# EAGLE design P3DA (EAGLE 7.7.0)
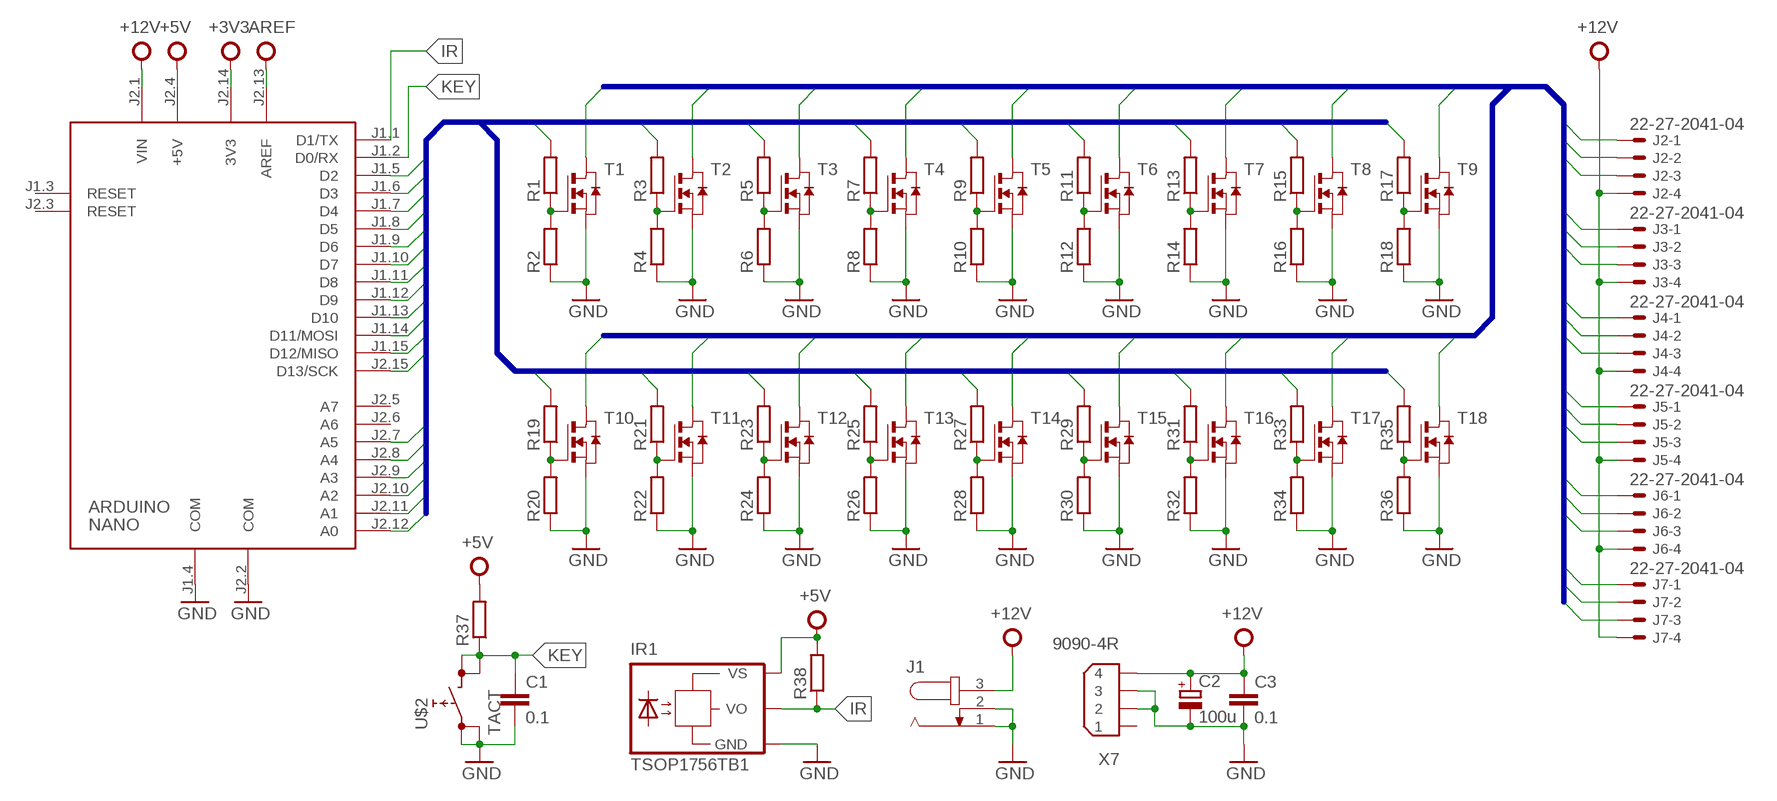
[diagram p0: schematic, sheet 1]

## Parts
ARDUINO  NANO  ARDUINO_NANO2  [ARDUINO_NANO2]
C1  0.1  C-EUC0805  [C0805]
C2  100u  CPOL-EUE5-13  [E5-13]
C3  0.1  C-EUC1206  [C1206]
IR1  TSOP1756TB1  [TSOP17_TB1]
J1  JACK-PLUG1  [SPC4078]
J2  22-27-2041-04  [6410-04]
J3  22-27-2041-04  [6410-04]
J4  22-27-2041-04  [6410-04]
J5  22-27-2041-04  [6410-04]
J6  22-27-2041-04  [6410-04]
J7  22-27-2041-04  [6410-04]
R1  R-EU_R0805  [R0805]
R2  R-EU_R0805  [R0805]
R3  R-EU_R0805  [R0805]
R4  R-EU_R0805  [R0805]
R5  R-EU_R0805  [R0805]
R6  R-EU_R0805  [R0805]
R7  R-EU_R0805  [R0805]
R8  R-EU_R0805  [R0805]
R9  R-EU_R0805  [R0805]
R10  R-EU_R0805  [R0805]
R11  R-EU_R0805  [R0805]
R12  R-EU_R0805  [R0805]
R13  R-EU_R0805  [R0805]
R14  R-EU_R0805  [R0805]
R15  R-EU_R0805  [R0805]
R16  R-EU_R0805  [R0805]
R17  R-EU_R0805  [R0805]
R18  R-EU_R0805  [R0805]
R19  R-EU_R0805  [R0805]
R20  R-EU_R0805  [R0805]
R21  R-EU_R0805  [R0805]
R22  R-EU_R0805  [R0805]
R23  R-EU_R0805  [R0805]
R24  R-EU_R0805  [R0805]
R25  R-EU_R0805  [R0805]
R26  R-EU_R0805  [R0805]
R27  R-EU_R0805  [R0805]
R28  R-EU_R0805  [R0805]
R29  R-EU_R0805  [R0805]
R30  R-EU_R0805  [R0805]
R31  R-EU_R0805  [R0805]
R32  R-EU_R0805  [R0805]
R33  R-EU_R0805  [R0805]
R34  R-EU_R0805  [R0805]
R35  R-EU_R0805  [R0805]
R36  R-EU_R0805  [R0805]
R37  R-EU_R0805  [R0805]
R38  R-EU_R0805  [R0805]
T1  NMOSSOT23  [SOT-23]
T2  NMOSSOT23  [SOT-23]
T3  NMOSSOT23  [SOT-23]
T4  NMOSSOT23  [SOT-23]
T5  NMOSSOT23  [SOT-23]
T6  NMOSSOT23  [SOT-23]
T7  NMOSSOT23  [SOT-23]
T8  NMOSSOT23  [SOT-23]
T9  NMOSSOT23  [SOT-23]
T10  NMOSSOT23  [SOT-23]
T11  NMOSSOT23  [SOT-23]
T12  NMOSSOT23  [SOT-23]
T13  NMOSSOT23  [SOT-23]
T14  NMOSSOT23  [SOT-23]
T15  NMOSSOT23  [SOT-23]
T16  NMOSSOT23  [SOT-23]
T17  NMOSSOT23  [SOT-23]
T18  NMOSSOT23  [SOT-23]
U$2  TACT  [TL1105]
X7  9090-4R  [9090-4R]

## Nets
+3V3: ARDUINO.J2.14(3V3)
+5V: ARDUINO.J2.4(+5V) IR1.VS R37.2 R38.2
+12V: ARDUINO.J2.1(VIN) C2.+ C3.1 J1.3 J2.4 J3.4 J4.4 J5.4 J6.4 J7.4 X7.4
AREF: ARDUINO.J2.13(AREF)
B1: J2.1 T3.1(D)
B2: J3.1 T6.1(D)
B3: J4.1 T9.1(D)
B4: J5.1 T12.1(D)
B5: J6.1 T15.1(D)
B6: J7.1 T18.1(D)
B_IN1: ARDUINO.J1.5(D2) R5.2
B_IN2: ARDUINO.J1.8(D5) R11.2
B_IN3: ARDUINO.J1.11(D8) R17.2
B_IN4: ARDUINO.J2.9(A3) R23.2
B_IN5: ARDUINO.J2.12(A0) R29.2
B_IN6: ARDUINO.J1.15(D12/MISO) R35.2
G1: J2.3 T2.1(D)
G2: J3.3 T5.1(D)
G3: J4.3 T8.1(D)
G4: J5.3 T11.1(D)
G5: J6.3 T14.1(D)
G6: J7.3 T17.1(D)
G_IN1: ARDUINO.J1.7(D4) R3.2
G_IN2: ARDUINO.J1.10(D7) R9.2
G_IN3: ARDUINO.J1.13(D10) R15.2
G_IN4: ARDUINO.J2.7(A5) R21.2
G_IN5: ARDUINO.J2.10(A2) R27.2
G_IN6: ARDUINO.J2.15(D13/SCK) R33.2
GND: ARDUINO.J1.4(COM) ARDUINO.J2.2(COM) C1.2 C2.- C3.2 IR1.GND J1.1 J1.2 R2.1 R4.1 R6.1 R8.1 R10.1 R12.1 R14.1 R16.1 R18.1 R20.1 R22.1 R24.1 R26.1 R28.1 R30.1 R32.1 R34.1 R36.1 T1.2(S) T2.2(S) T3.2(S) T4.2(S) T5.2(S) T6.2(S) T7.2(S) T8.2(S) T9.2(S) T10.2(S) T11.2(S) T12.2(S) T13.2(S) T14.2(S) T15.2(S) T16.2(S) T17.2(S) T18.2(S) U$2.1 U$2.3 X7.2 X7.3
IR: ARDUINO.J1.1(D1/TX) IR1.VO R38.1
KEY: ARDUINO.J1.2(D0/RX) C1.1 R37.1 U$2.2 U$2.4
N$2: R7.1 R8.2 T4.3(G)
N$3: R9.1 R10.2 T5.3(G)
N$5: R5.1 R6.2 T3.3(G)
N$6: R11.1 R12.2 T6.3(G)
N$7: R13.1 R14.2 T7.3(G)
N$8: R15.1 R16.2 T8.3(G)
N$9: R17.1 R18.2 T9.3(G)
N$10: R19.1 R20.2 T10.3(G)
N$11: R21.1 R22.2 T11.3(G)
N$12: R23.1 R24.2 T12.3(G)
N$13: R25.1 R26.2 T13.3(G)
N$14: R27.1 R28.2 T14.3(G)
N$15: R29.1 R30.2 T15.3(G)
N$16: R31.1 R32.2 T16.3(G)
N$17: R33.1 R34.2 T17.3(G)
N$18: R35.1 R36.2 T18.3(G)
N$19: R1.1 R2.2 T1.3(G)
N$20: R3.1 R4.2 T2.3(G)
R1: J2.2 T1.1(D)
R2: J3.2 T4.1(D)
R3: J4.2 T7.1(D)
R4: J5.2 T10.1(D)
R5: J6.2 T13.1(D)
R6: J7.2 T16.1(D)
R_IN1: ARDUINO.J1.6(D3) R1.2
R_IN2: ARDUINO.J1.9(D6) R7.2
R_IN3: ARDUINO.J1.12(D9) R13.2
R_IN4: ARDUINO.J2.8(A4) R19.2
R_IN5: ARDUINO.J2.11(A1) R25.2
R_IN6: ARDUINO.J1.14(D11/MOSI) R31.2
Unconnected: ARDUINO.J1.3(RESET) ARDUINO.J2.3(RESET) ARDUINO.J2.5(A7) ARDUINO.J2.6(A6) X7.1

## Buses
PWM:R_IN[1..6],G_IN[1..6],B_IN[1..6]
OUT:R[1..6],G[1..6],B[1..6]

## Library data of the parts
ARDUINO = arduino:ARDUINO_NANO2: Arduino Nano2 Auto generated by modulcreator.ulp \;; ANZAHL: 2; MODUL: TRUE; STECKX0: -76200; STECKX1: 76200; STECKY0: 177800; STECKY1: 177800
C1 C3 = rcl:C-EU: CAPACITOR, European symbol
C2 = rcl:CPOL-EU: POLARIZED CAPACITOR, European symbol
IR1 = telefunken:TSOP17*TB1: TSOP17..TB1 IR Receiver Modules for Remote Control Systems Source: http://www.vishay.com/docs/82042/82042.pdf; OC_FARNELL: unknown; OC_NEWARK: unknown
J1 = tango:JACK-PLUG: DC POWER JACK Power Jack, DC, Right Angle, Through Hole, Rated 5A at 16VDC, PC Terminals Distributor: Farnell (www.Farnell.de) Drawing: 84N1161.pdf / 84N1162.pdf Manufacturer: SPC Technology (www.spctechnology.com) Type: SPC4077 / SPC 4078
J2-J7 = EP_molex_6410_7395:22-?-04: CONNECTOR wire to board 2.54 mm (.1 inch) pitch header
R1-R38 = rcl:R-EU_: RESISTOR, European symbol
T1-T18 = zetex:NMOSSOT23: MOS FET; OC_FARNELL: unknown; OC_NEWARK: unknown
U$2 = switch1:TACT
X7 = con-thomas-betts:9090-4: Disk Drive Power four position Source: Thomas & Betts Electronic Interconnects Eiropean Edition 1998; OC_FARNELL: unknown; OC_NEWARK: unknown

## Board
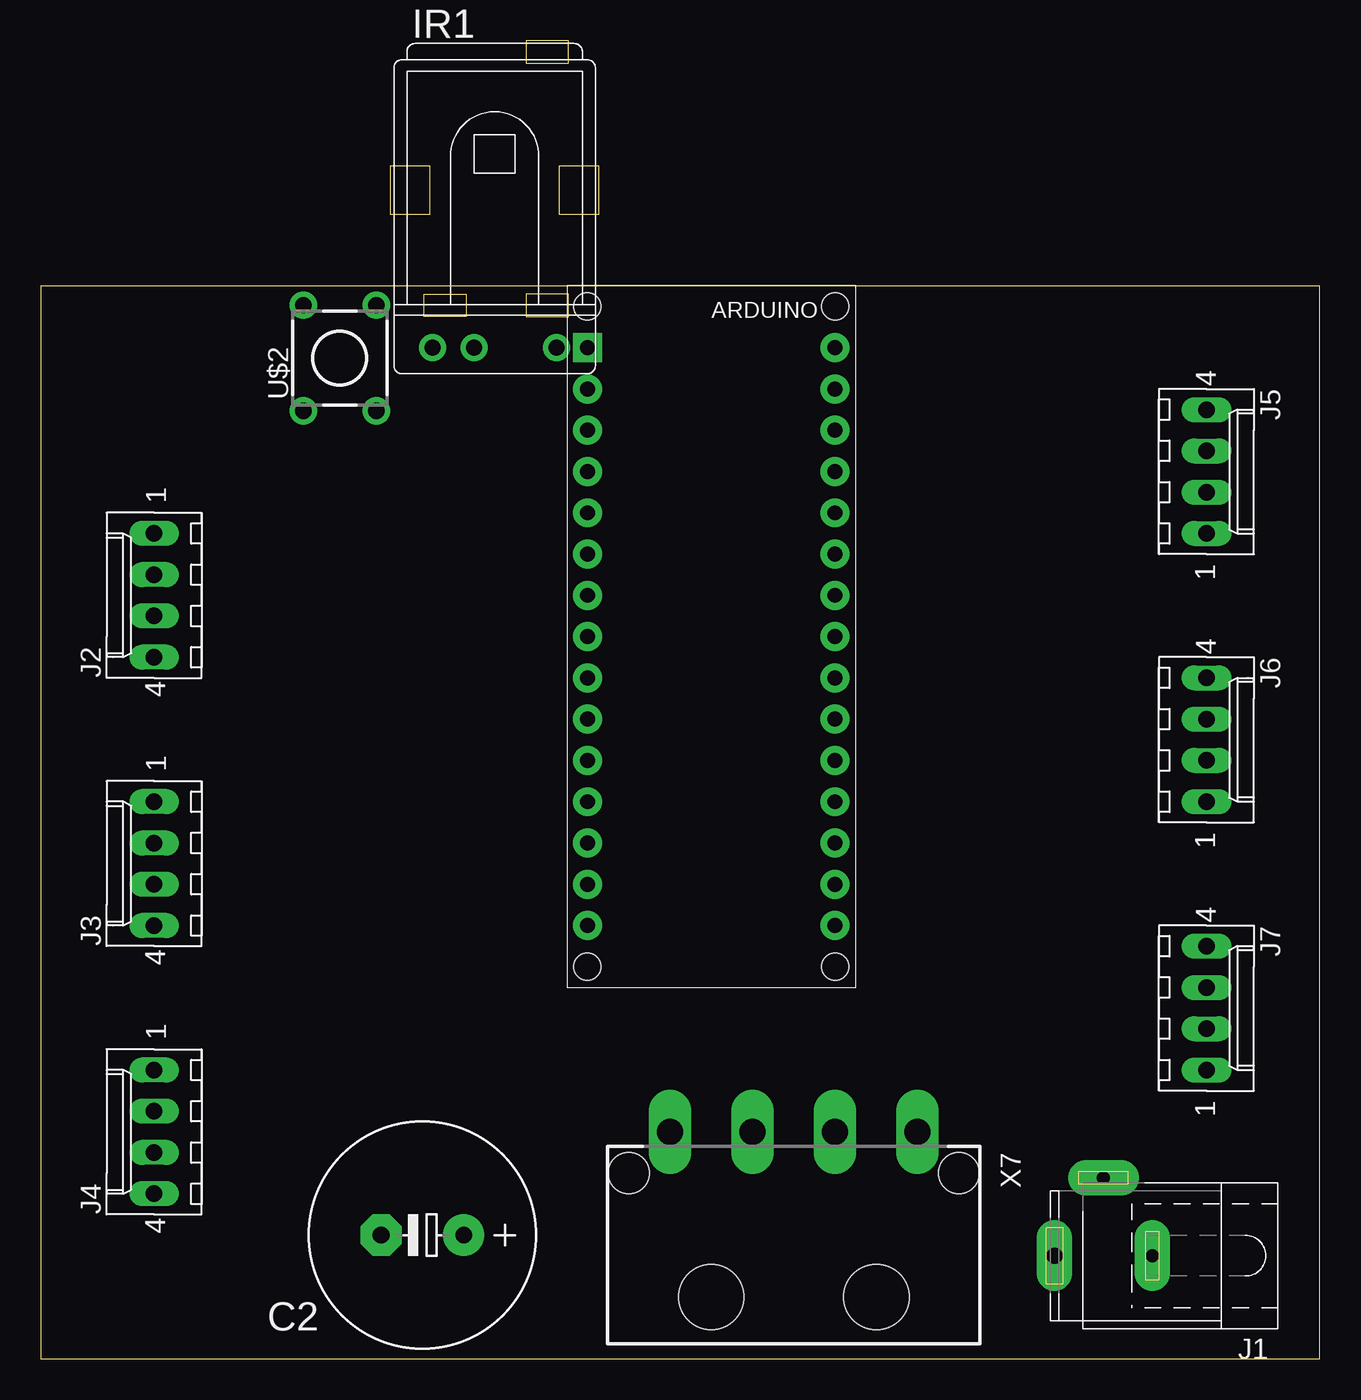
[diagram p1: board, top side]
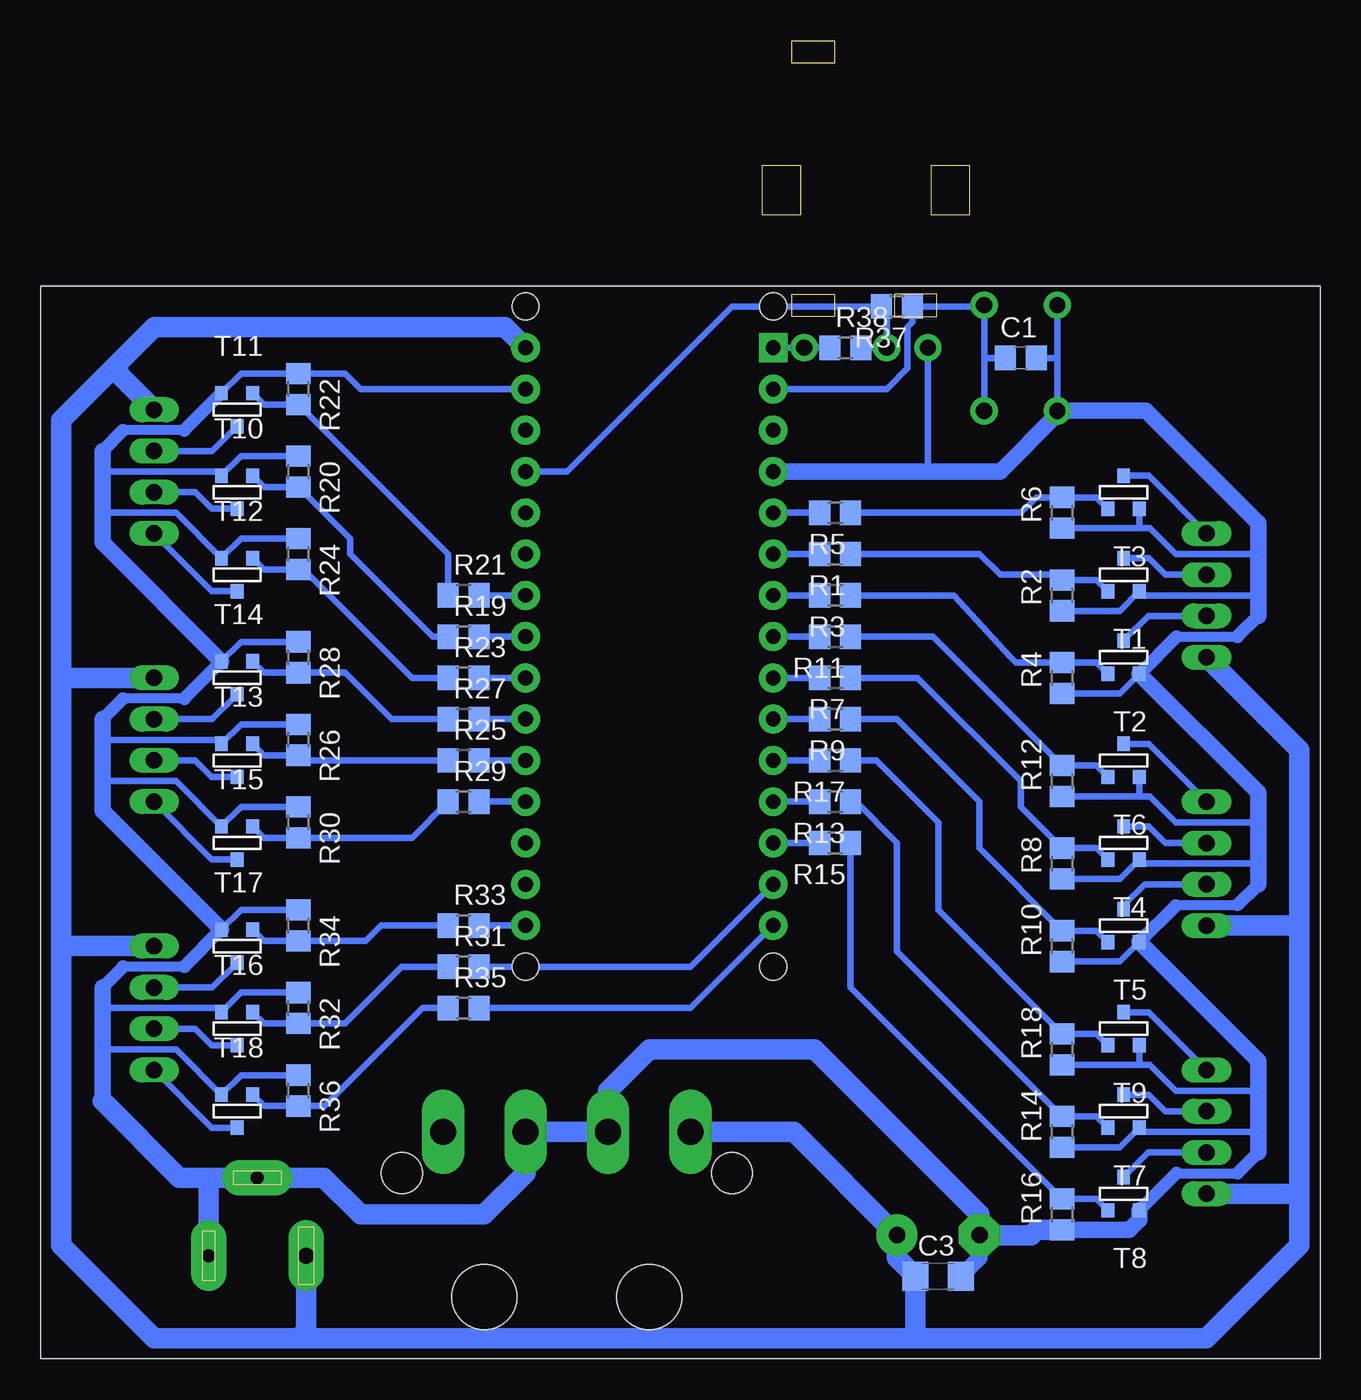
[diagram p2: board, bottom side, seen from below]

Size 78.73 x 66.03 mm. Coordinates in mm from the lower left corner, seen from the top.
Outline: 0,0 78.73,0 78.73,66.03 0,66.03 0,0
Copper layers (1*16): Top 0.035mm / dielectric 1.5mm / Bottom 0.035mm
Design rules "default": minimum track width 10mil, minimum drill 24mil, track to track 8mil, track to pad 8mil, pad to pad 8mil, via to via 8mil, smd to smd 8mil, copper to edge 40mil, drill to drill 8mil, minimum pad ring 10mil, minimum via ring 8mil, stop-mask expansion 4mil, vias tented up to drill 0mil, thermal gap 10mil

### Footprints (pad centres in the part's own frame; a part is rotated, then mirrored left to right if it is on the bottom)
ARDUINO_NANO2 = drill 0.914 pad 1.778 square: J1.1 -7.62,17.78 | drill 0.914 pad 1.778: J1.2 -7.62,15.24; J1.3 -7.62,12.7; J1.4 -7.62,10.16; J1.5 -7.62,7.62; J1.6 -7.62,5.08; J1.7 -7.62,2.54; J1.8 -7.62,0; J1.9 -7.62,-2.54; J1.10 -7.62,-5.08; J1.11 -7.62,-7.62; J1.12 -7.62,-10.16; J1.13 -7.62,-12.7; J1.14 -7.62,-15.24; J1.15 -7.62,-17.78; J2.1 7.62,17.78; J2.2 7.62,15.24; J2.3 7.62,12.7; J2.4 7.62,10.16; J2.5 7.62,7.62; J2.6 7.62,5.08; J2.7 7.62,2.54; J2.8 7.62,0; J2.9 7.62,-2.54; J2.10 7.62,-5.08; J2.11 7.62,-7.62; J2.12 7.62,-10.16; J2.13 7.62,-12.7; J2.14 7.62,-15.24; J2.15 7.62,-17.78 | hole 1.651: -7.62,-20.32; 7.62,-20.32; 7.62,20.32; -7.62,20.32
C0805 = smd 1.3 x 1.5: 1 -0.95,0; 2 0.95,0
E5-13 = drill 1.016 pad 2.54: + -2.54,0 | drill 1.016 pad 2.54 octagon: - 2.54,0
C1206 = smd 1.6 x 1.8: 1 -1.4,0; 2 1.4,0
TSOP17_TB1 = drill 1 pad 1.676: GND 0,-3.81; VO 0,3.81; VS 0,-1.27
SPC4078 = drill 0.8 pad 2.184 long: 1 -3,0; 2 0,-4.8 | drill 1 pad 2.184 long: 3 3,0
6410-04 = drill 1.016 long: 1 3.81,0; 2 1.27,0; 3 -1.27,0; 4 -3.81,0
R0805 = smd 1.3 x 1.5: 1 -0.95,0; 2 0.95,0
SOT-23 = smd 0.787 x 0.889: 1 0.025,-1.016; 2 -0.94,1.016; 3 0.991,1.016
TL1105 = drill 1 pad 1.676: 1 -2.25,3.25; 2 2.25,3.25; 3 -2.25,-3.25; 4 2.25,-3.25
9090-4R = drill 1.6 pad 2.6 long: 1 -7.62,-6.35; 2 -2.54,-6.35; 3 2.54,-6.35; 4 7.62,-6.35 | hole 4: -5.08,3.81; 5.08,3.81 | hole 2.5: -10.16,-3.81; 10.16,-3.81

### Placement (x,y rotation side)
ARDUINO  41.27,44.45 0 top
C1  18.41,61.59 0 bottom
C2  23.5,7.62 180 top
C3  23.5,5.08 0 bottom
IR1  27.94,62.23 270 top
J1  65.41,6.35 180 top
J2  6.99,46.99 90 top
J3  6.99,30.48 90 top
J4  6.99,13.97 90 top
J5  71.75,54.61 270 top
J6  71.75,38.1 270 top
J7  71.75,21.59 270 top
R1  29.84,49.53 180 bottom
R2  15.88,46.99 90 bottom
R3  29.84,46.99 180 bottom
R4  15.88,41.91 90 bottom
R5  29.84,52.07 180 bottom
R6  15.88,52.07 90 bottom
R7  29.84,41.91 180 bottom
R8  15.88,30.48 90 bottom
R9  29.84,39.37 180 bottom
R10  15.88,25.4 90 bottom
R11  29.84,44.45 180 bottom
R12  15.88,35.56 90 bottom
R13  29.84,34.29 180 bottom
R14  15.88,13.97 90 bottom
R15  29.84,31.75 180 bottom
R16  15.88,8.89 90 bottom
R17  29.84,36.83 180 bottom
R18  15.88,19.05 90 bottom
R19  52.7,44.45 0 bottom
R20  62.87,54.61 270 bottom
R21  52.7,46.99 0 bottom
R22  62.87,59.69 270 bottom
R23  52.7,41.91 0 bottom
R24  62.87,49.53 270 bottom
R25  52.7,36.83 0 bottom
R26  62.87,38.1 270 bottom
R27  52.7,39.37 0 bottom
R28  62.87,43.18 270 bottom
R29  52.7,34.29 0 bottom
R30  62.87,33.02 270 bottom
R31  52.7,24.13 0 bottom
R32  62.87,21.59 270 bottom
R33  52.7,26.67 0 bottom
R34  62.87,26.67 270 bottom
R35  52.7,21.59 0 bottom
R36  62.87,16.51 270 bottom
R37  26.04,64.77 180 bottom
R38  29.21,62.23 0 bottom
T1  12.06,48.26 180 bottom
T2  12.06,43.18 180 bottom
T3  12.06,53.34 180 bottom
T4  12.06,31.75 180 bottom
T5  12.06,26.67 180 bottom
T6  12.06,36.83 180 bottom
T7  12.06,15.24 180 bottom
T8  12.06,10.16 180 bottom
T9  12.06,20.32 180 bottom
T10  66.67,53.34 0 bottom
T11  66.67,58.42 0 bottom
T12  66.67,48.26 0 bottom
T13  66.67,36.83 0 bottom
T14  66.67,41.91 0 bottom
T15  66.67,31.75 0 bottom
T16  66.67,20.32 0 bottom
T17  66.67,25.4 0 bottom
T18  66.67,15.24 0 bottom
U$2  18.41,61.59 0 top
X7  46.35,7.62 180 top

### Tracks (layer width: path | path; a pad name or v marks a point on that pad's centre or on a via)
+5V
  Bottom 0.406: ARDUINO.J2.4 46.35,54.61 36.2,64.77 R37.2 26.67,64.45 IR1.VS R38.2
+12V
  Bottom 1.27: ARDUINO.J2.1 50.16,63.5 71.75,63.5 73.98,61.28 | 24.77,1.27 6.99,1.27 1.27,6.99 1.27,10.16 | 24.77,1.27 62.87,1.27 | 62.87,1.27 71.75,1.27 77.47,6.99 77.47,25.4 | 77.47,25.4 77.47,41.91 | 77.47,41.91 77.47,57.78 73.98,61.28 | 1.27,26.67 1.27,37.47 J2.4 | 1.27,26.67 1.27,10.16 | J1.3 62.41,1.73 62.87,1.27 | 24.77,1.27 24.89,1.4 C3.1 26.04,6.22 C2.+ 32.38,13.97 X7.4 | 1.27,26.67 J3.4 | J4.4 1.27,10.16 | J5.4 73.98,60.64 73.98,61.28 | J6.4 77.47,41.91 | J7.4 77.47,25.4
B1
  Bottom 0.406: J2.1 10.54,54.36 T3.1
B2
  Bottom 0.406: J3.1 10.54,37.85 T6.1
B3
  Bottom 0.406: J4.1 10.54,21.34 T9.1
B4
  Bottom 0.406: J5.1 68.2,47.24 T12.1
B5
  Bottom 0.406: J6.1 68.2,30.73 T15.1
B6
  Bottom 0.406: J7.1 68.2,14.22 T18.1
B_IN1
  Bottom 0.406: ARDUINO.J1.5 R5.2
B_IN2
  Bottom 0.406: ARDUINO.J1.8 R11.2
B_IN3
  Bottom 0.406: ARDUINO.J1.11 R17.2
B_IN4
  Bottom 0.406: ARDUINO.J2.9 R23.2
B_IN5
  Bottom 0.406: ARDUINO.J2.12 R29.2
B_IN6
  Bottom 0.406: R35.2 38.73,21.59 ARDUINO.J1.15
G1
  Bottom 0.406: J2.3 10.57,45.72 T2.1
G2
  Bottom 0.406: J3.3 10.79,29.21 12.09,27.91 T5.1
G3
  Bottom 0.406: J4.3 10.57,12.7 T8.1
G4
  Bottom 0.406: J5.3 68.17,55.88 T11.1
G5
  Bottom 0.406: J6.3 68.17,39.37 T14.1
G6
  Bottom 0.406: J7.3 68.17,22.86 T17.1
G_IN1
  Bottom 0.406: ARDUINO.J1.7 R3.2
G_IN2
  Bottom 0.406: ARDUINO.J1.10 R9.2
G_IN3
  Bottom 0.406: ARDUINO.J1.13 R15.2
G_IN4
  Bottom 0.406: ARDUINO.J2.7 R21.2
G_IN5
  Bottom 0.406: ARDUINO.J2.10 R27.2
G_IN6
  Bottom 0.406: R33.2 ARDUINO.J2.15
GND
  Bottom 0.406: R6.1 11.12,51.12 | R2.1 12.33,46.04 T1.2 10.87,46.99 3.81,46.99 | R4.1 12.33,40.96 T2.2 | R12.1 11.12,34.61 | R8.1 12.33,29.53 T4.2 10.87,30.48 3.81,30.48 | R10.1 12.33,24.45 T5.2 | R18.1 11.12,18.1 | R14.1 12.33,13.02 T7.2 10.87,13.97 3.81,13.97 | T11.2 66.41,60.64 R22.1 | R20.1 66.41,55.56 T10.2 67.87,54.61 74.93,54.61 | R24.1 66.41,50.48 T12.2 70.41,52.07 74.93,52.07 | T14.2 66.41,44.13 R28.1 | R26.1 66.41,39.05 T13.2 67.87,38.1 74.93,38.1 | R30.1 66.41,33.97 T15.2 70.41,35.56 74.93,35.56 | T17.2 66.41,27.62 R34.1 | R32.1 66.41,22.54 T16.2 67.87,21.59 74.93,21.59 | R22.1 64.45,60.64 | 16.16,58.13 U$2.3 16.16,61.59 | 16.16,61.59 U$2.1 | C1.2 16.16,61.59 | 11.12,51.12 T3.2 | 11.12,18.1 T9.2 | 11.12,34.61 T6.2 | 11.12,34.61 10.48,34.61 8.89,33.02 3.81,33.02 | 8.89,27.89 8.89,27.94 | 11.12,51.12 10.48,51.12 8.89,49.53 3.81,49.53 | 11.12,18.1 10.48,18.1 8.89,16.51 3.81,16.51 | 74.93,19.05 70.41,19.05 T18.2 66.41,17.46 R36.1 | R22.1 60.01,60.64 59.05,59.69 ARDUINO.J2.2 | IR1.GND 24.13,54.61
  Bottom 0.61: 8.89,27.94 5.08,27.94 | 8.84,44.45 5.08,44.45 | 8.84,11.43 5.08,11.43 | 69.9,57.15 73.66,57.15 | 69.9,40.64 73.66,40.64 | 69.9,24.13 73.66,24.13
  Bottom 0.813: T5.2 8.89,27.89 | T2.2 8.84,44.45 | 5.08,44.45 3.81,45.72 | T8.2 8.84,11.43 | T11.2 69.9,57.15 | T14.2 69.9,40.64 | T17.2 69.9,24.13 | 3.81,29.21 5.08,27.94 | 3.81,12.7 5.08,11.43 | 74.93,22.86 73.66,24.13 | 73.66,40.64 74.93,39.37 | 73.66,57.15 74.93,55.88
  Bottom 1.016: R16.1 11.74,7.94 11.12,8.56 T8.2 | ARDUINO.J1.4 24.13,54.61 19.68,54.61 16.16,58.13 | 3.81,45.72 3.81,46.99 3.81,49.53 3.81,51.44 10.72,58.34 U$2.3 | T2.2 3.81,34.85 3.81,33.02 3.81,30.48 3.81,29.21 | T5.2 3.81,18.34 3.81,16.51 3.81,13.97 3.81,12.7 | T17.2 74.93,33.73 74.93,35.56 74.93,38.1 74.93,39.37 | T14.2 74.93,50.24 74.93,52.07 74.93,54.61 74.93,55.88 | J1.2 66.04,11.15 | 74.93,15.88 74.93,19.05 74.93,21.59 74.93,22.86 | C3.2 20.95,6.22 C2.-
  Bottom 1.27: 68.41,11.15 70.2,11.15 74.93,15.88 | J1.2 61.31,11.15 59.05,8.89 51.44,8.89 48.9,11.43 X7.2 X7.3 43.81,16.51 41.27,19.05 31.11,19.05 20.95,8.89 C2.- 17.78,7.62 17.46,7.94 R16.1 | J1.1 68.41,11.15 | 68.41,11.15 66.04,11.15
IR
  Bottom 0.406: R38.1 IR1.VO ARDUINO.J1.1
KEY
  Bottom 0.406: U$2.4 20.66,61.59 | 20.66,61.59 U$2.2 20.74,64.77 R37.1 25.09,63.81 25.4,63.5 25.4,60.96 26.67,59.69 ARDUINO.J1.2 | C1.1 20.66,61.59
N$1
  Bottom 0: 0,0 0,66.04 78.74,66.04 78.74,0 0,0
N$2
  Bottom 0.406: T4.3 13.75,31.43 R8.2 18.41,33.97 18.41,35.56 24.77,41.91 R7.1
N$3
  Bottom 0.406: T5.3 13.75,26.35 R10.2 20.95,31.43 20.95,34.29 26.04,39.37 R9.1
N$5
  Bottom 0.406: T3.3 13.75,53.02 R6.2 17.46,53.02 18.41,52.07 R5.1
N$6
  Bottom 0.406: T6.3 13.75,36.51 R12.2 23.82,44.45 R11.1
N$7
  Bottom 0.406: T7.3 13.75,14.92 R14.2 26.04,25.08 26.04,31.75 28.57,34.29 R13.1
N$8
  Bottom 0.406: T8.3 13.75,9.84 R16.2 28.89,22.86 R15.1
N$9
  Bottom 0.406: T9.3 13.75,20 R18.2 23.5,27.62 23.5,33.02 27.3,36.83 R17.1
N$10
  Bottom 0.406: T10.3 64.99,53.66 R20.2 59.69,50.48 59.69,49.53 54.61,44.45 R19.1
N$11
  Bottom 0.406: T11.3 64.99,58.74 R22.2 53.66,49.53 R21.1
N$12
  Bottom 0.406: T12.3 64.99,48.58 R24.2 62.55,48.58 55.88,41.91 R23.1
N$13
  Bottom 0.406: T13.3 64.99,37.15 R26.2 62.55,36.83 R25.1
N$14
  Bottom 0.406: T14.3 64.99,42.23 R28.2 60.01,42.23 57.15,39.37 R27.1
N$15
  Bottom 0.406: T15.3 64.99,32.07 R30.2 55.88,32.07 R29.1
N$16
  Bottom 0.406: T16.3 64.99,20.64 R32.2 60.01,20.64 56.52,24.13 R31.1
N$17
  Bottom 0.406: T17.3 64.99,25.72 R34.2 58.73,25.72 57.78,26.67 R33.1
N$18
  Bottom 0.406: T18.3 64.99,15.56 R36.2 61.27,15.56 55.24,21.59 R35.1
N$19
  Bottom 0.406: T1.3 13.75,47.94 R2.2 16.2,48.26 19.68,48.26 20.95,49.53 R1.1
N$20
  Bottom 0.406: T2.3 13.75,42.86 R4.2 18.73,42.86 19.05,43.18 22.55,46.99 R3.1
R1
  Bottom 0.406: J2.2 9.53,48.26 10.54,49.28 T1.1
R2
  Bottom 0.406: J3.2 9.53,31.75 10.54,32.77 T4.1
R3
  Bottom 0.406: J4.2 9.53,15.24 10.54,16.26 T7.1
R4
  Bottom 0.406: J5.2 69.22,53.34 68.2,52.32 T10.1
R5
  Bottom 0.406: J6.2 69.22,36.83 68.2,35.81 T13.1
R6
  Bottom 0.406: J7.2 69.22,20.32 68.2,19.3 T16.1
R_IN1
  Bottom 0.406: ARDUINO.J1.6 R1.2
R_IN2
  Bottom 0.406: ARDUINO.J1.9 R7.2
R_IN3
  Bottom 0.406: ARDUINO.J1.12 R13.2
R_IN4
  Bottom 0.406: ARDUINO.J2.8 R19.2
R_IN5
  Bottom 0.406: ARDUINO.J2.11 R25.2 52.07,36.83
R_IN6
  Bottom 0.406: R31.2 38.73,24.13 ARDUINO.J1.14